# EAGLE design 7seg-main (EAGLE 6.4)
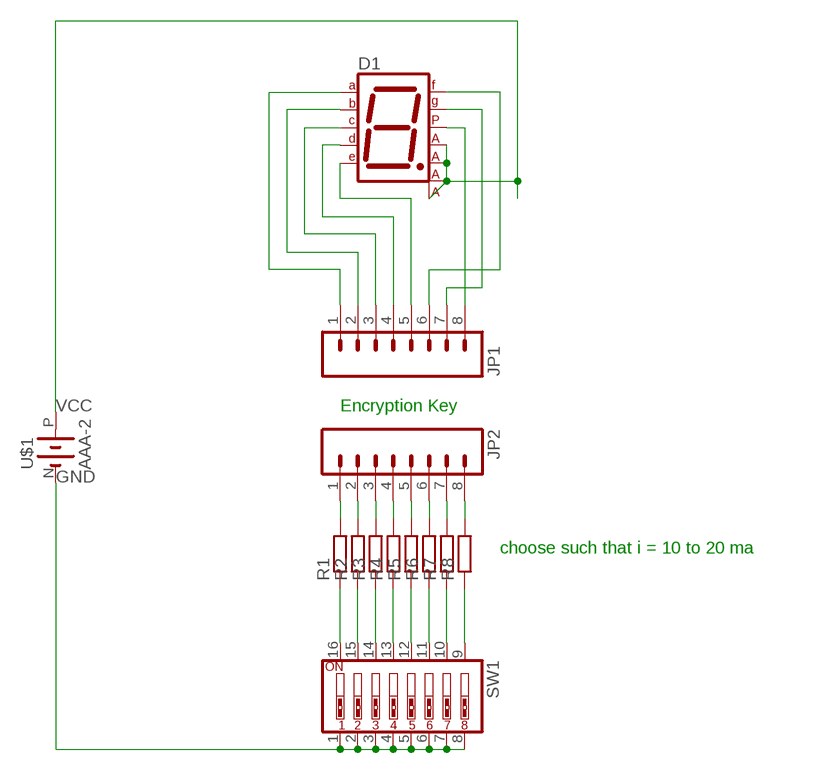
[diagram p0: schematic, sheet 1]

## Parts
D1  7SEG-CA-204  [7SEG-0.8IN]
JP1  M08LOCK_LONGPADS  [1X08_LOCK_LONGPADS]
JP2  M08LOCK_LONGPADS  [1X08_LOCK_LONGPADS]
R1  RESISTOR_0207/10  [0207/10]
R2  RESISTOR_0207/10  [0207/10]
R3  RESISTOR_0207/10  [0207/10]
R4  RESISTOR_0207/10  [0207/10]
R5  RESISTOR_0207/10  [0207/10]
R6  RESISTOR_0207/10  [0207/10]
R7  RESISTOR_0207/10  [0207/10]
R8  RESISTOR_0207/10  [0207/10]
SW1  SW_DIP-8  [EDG-08]
U$1  AAA-2  [AA-2]

## Nets
GND [larger]: SW1.1 SW1.2 SW1.3 SW1.4 SW1.5 SW1.6 SW1.7 SW1.8 U$1.N(-)
N$1: R1.1 SW1.16
N$2: D1.9(DP) JP1.8
N$3: JP2.1 R1.2
N$4: JP2.2 R2.2
N$5: JP2.3 R3.2
N$6: JP2.4 R4.2
N$7: JP2.5 R5.2
N$8: JP2.6 R6.2
N$9: JP2.7 R7.2
N$10: JP2.8 R8.2
N$11: R2.1 SW1.15
N$12: R3.1 SW1.14
N$13: R4.1 SW1.13
N$14: R5.1 SW1.12
N$15: R6.1 SW1.11
N$16: R7.1 SW1.10
N$17: R8.1 SW1.9
N$20: D1.13(G) JP1.7
N$21: D1.2(F) JP1.6
N$22: D1.4(E) JP1.5
N$23: D1.10(D) JP1.4
N$24: D1.12(C) JP1.3
N$25: D1.14(B) JP1.2
N$26: D1.1(A) JP1.1
VCC [larger]: D1.3(CA1) D1.5(CA2) D1.11(CA3) D1.16(CA4) U$1.P(+)

## Notes on the sheet
- Encryption Key
- choose such that i = 10 to 20 ma

## Library data of the parts
D1 = SwitchAndLockingPins:7SEG-CA-204: 7-segment DISPLAY single anode, 25.4mm
JP1 JP2 = SparkFun-Connectors:M08: Header 8 Standard 8-pin 0.1" header. Use with straight break away headers (SKU : PRT-00116), right angle break away headers (PRT-00553), swiss pins (PRT-00743), machine pins (PRT-00117), and female headers (PRT-00115).
R1-R8 = SwitchAndLockingPins:RESISTOR_: RESISTOR If you're not sure what to use, go for 0207/10 or 0207/12 How it works You can choose different sizes and shapes of resistor - standard, 1/4W resistors are "0207". The number following indicates the hole spacing. V indicates whether the resistor is vertical, or normally mounted. If you find that, when laying out your PCB, you need to swap to a vertical resistor for a layout reason, you can use Part Swap to change the resistor package easily.
SW1 = special:SW_DIP-8: DIP SWITCH
U$1 = DoubleAAA:AAA-2

## Net classes
0 default: width 0.61 mm
1 larger: width 0.813 mm

## Board
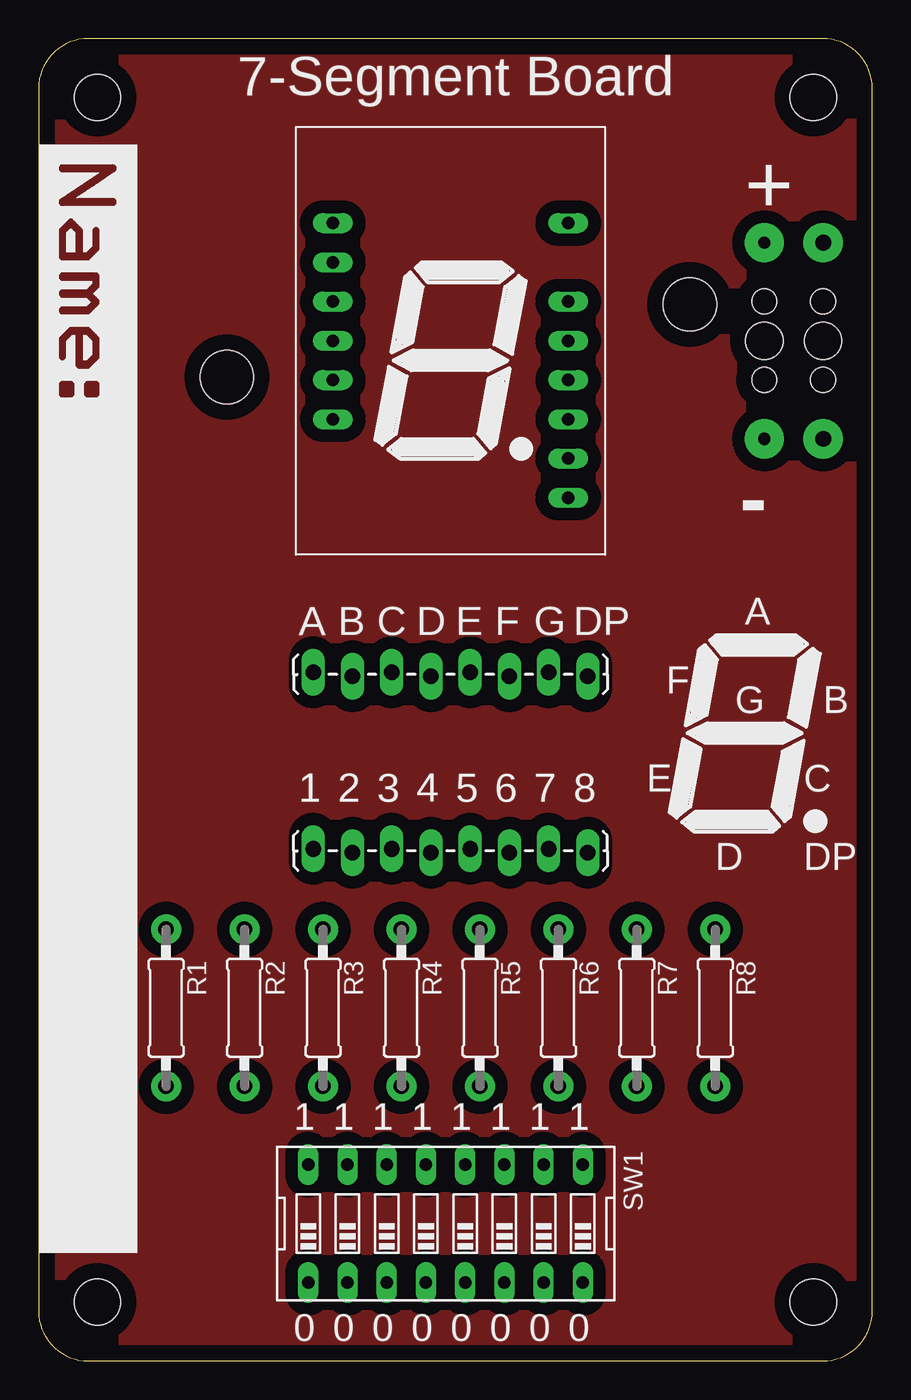
[diagram p1: board, top side]
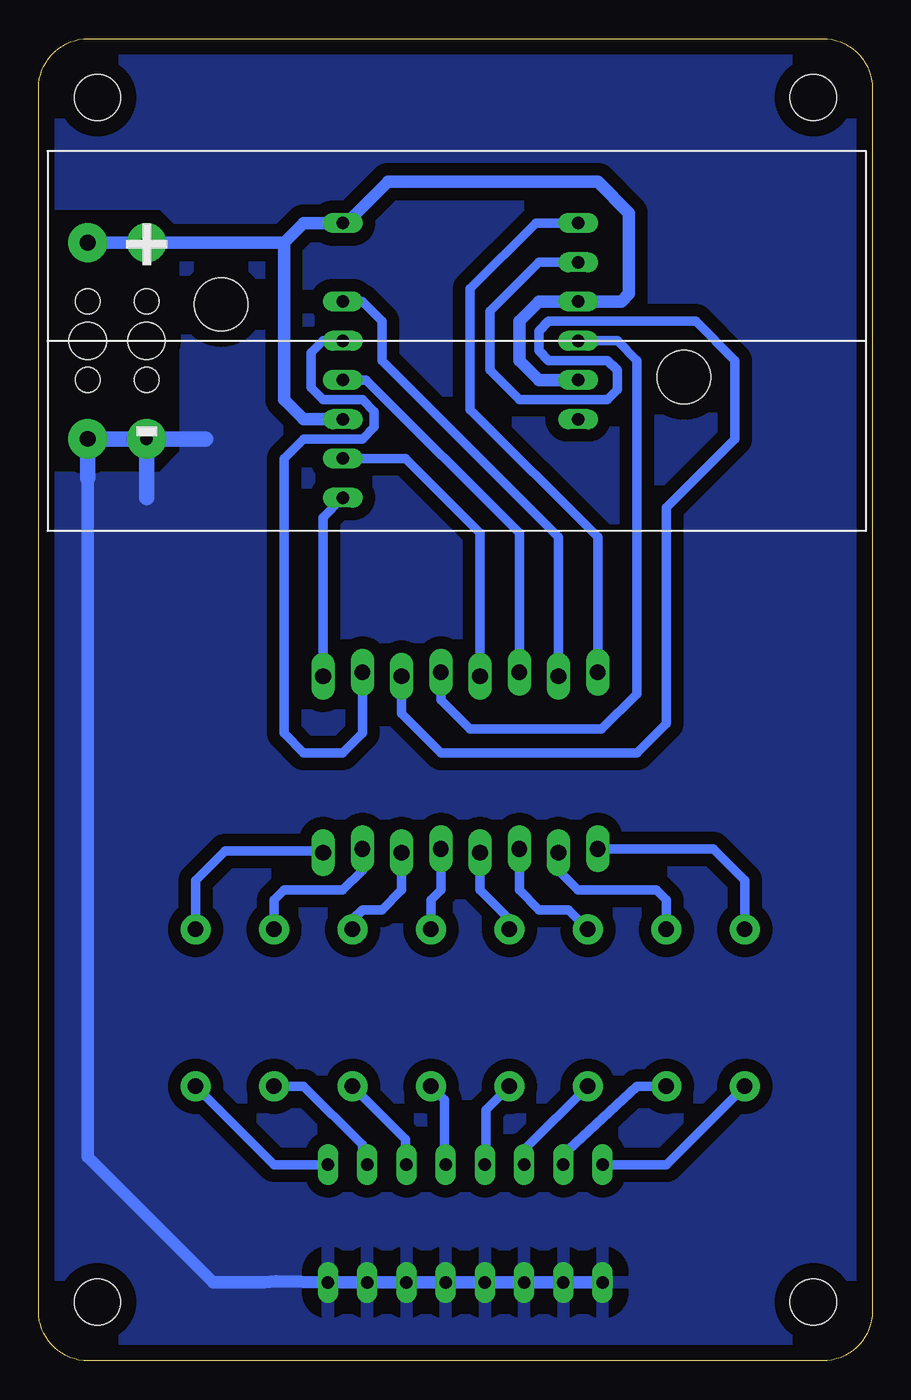
[diagram p2: board, bottom side, seen from below]

Size 53.98 x 85.6 mm. Coordinates in mm from the lower left corner, seen from the top.
Outline: 0,82.4 0,3.2 arc90 3.2,0 50.78,0 arc90 53.98,3.2 53.98,82.4 arc90 50.78,85.6 3.2,85.6 arc90 0,82.4
Copper layers (1*16): Top 0.035mm / dielectric 1.5mm / Bottom 0.035mm
Design rules "default *": minimum track width 10mil, minimum drill 24mil, track to track 16mil, track to pad 12mil, pad to pad 8mil, via to via 8mil, smd to smd 8mil, copper to edge 40mil, drill to drill 8mil, minimum pad ring 10mil, minimum via ring 8mil, stop-mask expansion 4mil, vias tented up to drill 0mil, thermal gap 40mil
Holes 3 mm at 3.81,81.79 50.17,81.79 3.81,3.81 50.17,3.81
Holes 1.6 mm at 50.8,68.58 50.8,63.5 46.99,63.5 46.99,68.58
Holes 2.4 mm at 50.8,66.04 46.99,66.04

### Footprints (pad centres in the part's own frame; a part is rotated, then mirrored left to right if it is on the bottom)
7SEG-0.8IN = drill 0.8 long: 1 -7.62,7.62; 2 -7.62,5.08; 3 -7.62,2.54; 4 -7.62,0; 5 -7.62,-2.54; 6 -7.62,-5.08; 9 7.62,-10.16; 10 7.62,-7.62; 11 7.62,-5.08; 12 7.62,-2.54; 13 7.62,0; 14 7.62,2.54; 16 7.62,7.62
1X08_LOCK_LONGPADS = drill 1.016 long: 1 0,0.127; 2 2.54,-0.127; 3 5.08,0.127; 4 7.62,-0.127; 5 10.16,0.127; 6 12.7,-0.127; 7 15.24,0.127; 8 17.78,-0.127
0207/10 = drill 1 pad 1.93: 1 -5.08,0; 2 5.08,0
EDG-08 = drill 0.813 long: 1 -8.89,-3.81; 2 -6.35,-3.81; 3 -3.81,-3.81; 4 -1.27,-3.81; 5 1.27,-3.81; 6 3.81,-3.81; 7 6.35,-3.81; 8 8.89,-3.81; 9 8.89,3.81; 10 6.35,3.81; 11 3.81,3.81; 12 1.27,3.81; 13 -1.27,3.81; 14 -3.81,3.81; 15 -6.35,3.81; 16 -8.89,3.81
AA-2 = drill 1.02 pad 2.54: N 0,12.7; P 0,0 | hole 3.45: -8.64,4; -38.61,8.7

### Placement (x,y rotation side)
D1  26.67,66.04 0 top
JP1  17.78,44.45 0 top
JP2  17.78,33.02 0 top
R1  8.26,22.86 90 top
R2  13.34,22.86 90 top
R3  18.41,22.86 90 top
R4  23.5,22.86 90 top
R5  28.57,22.86 90 top
R6  33.66,22.86 90 top
R7  38.73,22.86 90 top
R8  43.81,22.86 90 top
SW1  26.35,8.89 0 top
U$1  50.8,72.39 180 bottom

### Tracks (layer width: path | path; a pad name or v marks a point on that pad's centre or on a via)
GND  (via drill 0.8 pad 2.54)
  Bottom 0.813: SW1.1 SW1.2 SW1.3 SW1.4 SW1.5 SW1.6 SW1.7 SW1.8 38.61,5.14 39.37,5.08 42.67,5.08 50.8,13.21 50.8,57.15
  Bottom 1.016: v46.99,59.69 43.18,59.69 | v46.99,59.69 U$1.N 50.8,57.15 | v46.99,59.69 46.99,55.88
  pour Bottom (isolate 0.813, rank 5): 1.27,1.27 53.34,1.27 53.34,57.15 46.02,57.15 44.45,58.72 44.45,73.36 46.02,74.93 53.34,74.93 53.34,85.09 1.27,85.09
N$1
  Bottom 0.61: SW1.16 13.34,12.7 R1.1
N$2
  Bottom 0.61: JP1.8 35.56,54.61 D1.9
N$3
  Bottom 0.61: JP2.1 10.29,33.15 8.26,31.11 R1.2
N$4
  Bottom 0.61: 20.32,33.02 JP2.2 20.32,31.75 19.05,30.48 13.97,30.48 13.34,29.84 R2.2
N$5
  Bottom 0.61: R3.2 19.68,29.21 21.59,29.21 22.86,30.48 JP2.3
N$6
  Bottom 0.61: JP2.4 25.4,30.48 23.5,28.57 R4.2
N$7
  Bottom 0.61: JP2.5 27.94,30.48 28.57,29.84 R5.2
N$8
  Bottom 0.61: JP2.6 30.48,31.75 30.48,30.48 31.75,29.21 33.02,29.21 33.66,28.57 R6.2
N$9
  Bottom 0.61: JP2.7 33.02,33.02 33.02,31.75 34.29,30.48 38.1,30.48 38.73,29.84 R7.2
N$10
  Bottom 0.61: JP2.8 35.69,33.02 41.91,33.02 43.81,31.11 R8.2
N$11
  Bottom 0.61: R2.1 15.24,17.78 19.68,13.65 19.68,13.27 19.94,12.7 SW1.15
N$12
  Bottom 0.61: R3.1 22.48,13.72 22.48,12.7 SW1.14
N$13
  Bottom 0.61: R4.1 25.02,16.26 25.02,12.7 SW1.13
N$14
  Bottom 0.61: R5.1 27.69,16.89 27.69,12.7 SW1.12
N$15
  Bottom 0.61: R6.1 30.23,14.35 30.23,12.7 SW1.11
N$16
  Bottom 0.61: R7.1 37.85,17.78 38.1,17.78 36.83,17.78 33.02,13.97 33.02,12.95 32.77,12.7 SW1.10
N$17
  Bottom 0.61: SW1.9 38.73,12.7 R8.1
N$18
  pour Bottom (isolate 2.54): 36.51,59.69 19.05,59.69 19.05,57.15 16.51,57.15 16.51,59.69 12.7,59.69 12.7,65.41 36.51,65.41
N$20
  Bottom 0.61: D1.13 35.56,66.04 36.32,65.28 36.32,62.99 35.56,62.23 33.02,62.23 32.26,61.47 32.26,60.45 33.02,59.69 36.83,59.69 38.1,58.42 38.1,40.64 36.83,39.37 34.29,39.37 33.02,40.64 JP1.7
N$21
  Bottom 0.61: D1.2 21.59,71.12 24.77,67.94 24.77,64.14 22.86,62.23 17.14,62.23 16.51,62.87 16.51,64.14 17.14,64.77 20.95,64.77 21.59,65.41 21.59,66.67 20.95,67.31 11.43,67.31 8.89,64.77 8.89,59.69 13.34,55.24 13.34,41.27 15.24,39.37 27.94,39.37 30.48,41.91 JP1.6
N$22
  Bottom 0.61: D1.4 16.51,66.04 15.24,64.77 15.24,43.18 17.53,40.89 26.04,40.89 27.94,42.8 JP1.5 27.94,44.07
N$23
  Bottom 0.61: D1.10 30.23,58.42 25.4,53.59 JP1.4
N$24
  Bottom 0.61: D1.12 32.77,63.5 22.86,53.59 JP1.3
N$25
  Bottom 0.61: JP1.2 20.32,53.34 31.75,64.77 31.75,67.31 33.02,68.58 D1.14
N$26
  Bottom 0.61: D1.1 21.77,73.66 26.04,69.4 26.04,61.59 17.78,53.34 JP1.1
N$27
  pour Bottom (isolate 1.93): 39.37,15.24 12.7,15.24 13.97,13.97 38.1,13.97
N$28
  pour Top (isolate 0.813): 1.27,85.09 53.34,85.09 53.34,72.39 48.26,72.39 45.72,69.85 45.72,62.23 48.26,59.69 53.34,59.69 53.34,1.27 1.27,1.27
N$29
  pour Bottom (isolate 2.718): 35.56,41.27 26.67,41.27 26.67,44.45 35.56,44.45
N$30
  pour Bottom (isolate 2.032): 36.83,29.21 15.24,29.21 15.24,30.48 36.83,30.48
N$31
  pour Bottom (isolate 1.27): 43.18,71.12 39.37,71.12 39.37,69.85 43.18,69.85
VCC  (via drill 0.8 pad 2.54)
  Bottom 0.813: D1.5 21.59,63.5 22.86,64.77 22.86,67.31 21.59,68.58 D1.3 | 18.67,68.71 D1.3 | D1.3 16.26,68.58 15.75,69.09 15.75,74.3 17.78,76.33 31.37,76.33 33.91,73.79 D1.16 36.83,73.66 38.1,72.39 | 38.1,72.39 v46.99,72.39 U$1.P | D1.11 36.83,60.96 38.1,62.23 38.1,72.39

### Text on the board
tPlace: 7-Segment Board | + | - | A | A | B | C | D | E | F | G | DP | F | G | B | E | C | 1 | 2 | 3 | 4 | 5 | 6 | 7 | 8 | D | DP | 1 | 1 | 1 | 1 | 1 | 1 | 1 | 1 | 0 | 0 | 0 | 0 | 0 | 0 | 0 | 0
tDocu: Note: Need bRestrict to remove random ugly islands of copper.